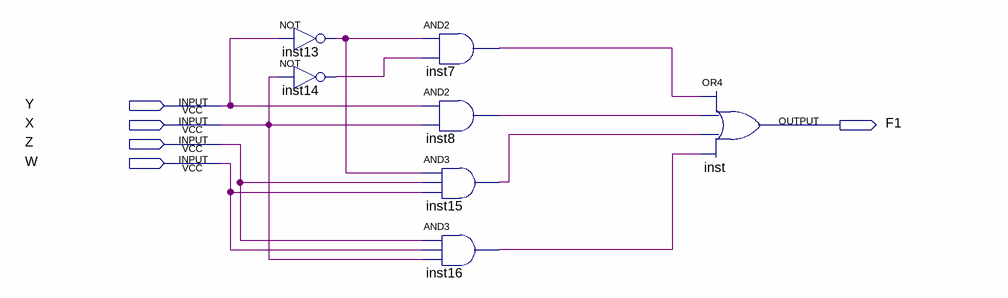
[diagram p0: schematic sheet]
// Quartus schematic EE133_HW1.bdf as structural Verilog: 7 symbols, 5 pins
module EE133_HW1 (
  input  Y,
  input  X,
  input  Z,
  input  W,
  output F1
);

  wire inst7_out, inst8_out, inst13_out, inst14_out, inst15_out, inst16_out;

  not inst13 (inst13_out, Y);
  not inst14 (inst14_out, X);
  and inst7 (inst7_out, inst13_out, inst14_out);
  and inst8 (inst8_out, Y, X);
  and inst15 (inst15_out, inst13_out, Z, W);
  and inst16 (inst16_out, Z, W, X);
  or inst (F1, inst7_out, inst8_out, inst15_out, inst16_out);
endmodule
